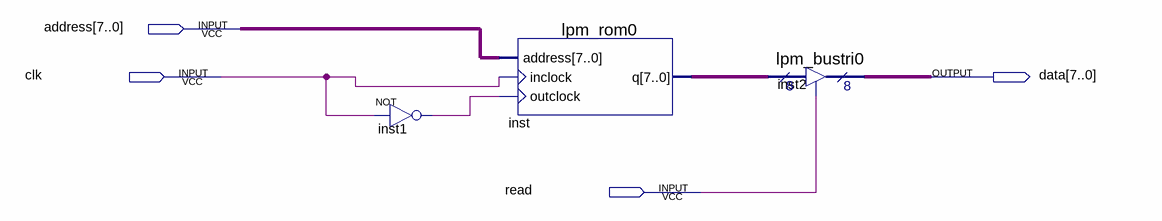
[diagram p0: schematic sheet]
// Quartus schematic rom.bdf as structural Verilog: 3 symbols, 4 pins
module rom (
  input  [7:0] address,
  input  clk,
  input  read,
  output [7:0] data
);

  wire inst1_out;
  wire [7:0] inst_q;

  not inst1 (inst1_out, clk);
  lpm_rom0 inst (.address(address), .inclock(clk), .outclock(inst1_out), .q(inst_q));
  lpm_bustri0 inst2 (.enabledt(read), .data(inst_q), .tridata(data));
endmodule
